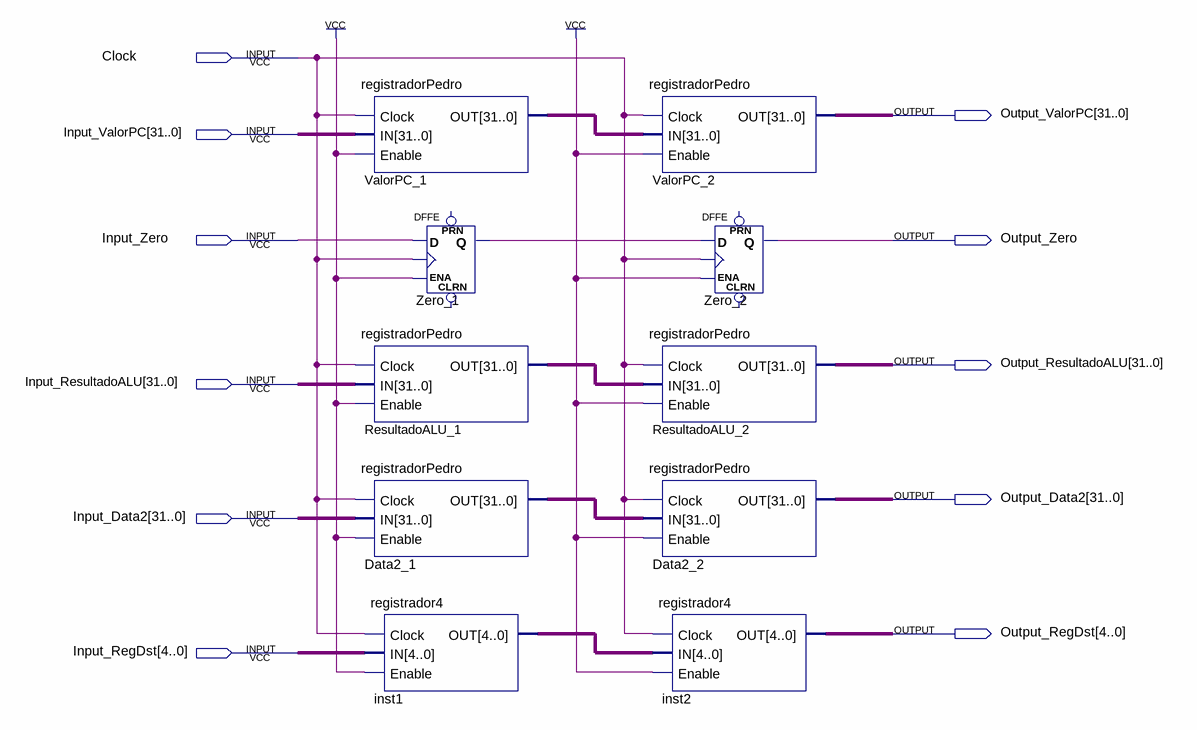
[diagram p0: schematic sheet]
// Quartus schematic barreira_EX_MEM.bdf as structural Verilog: 10 symbols, 11 pins
module barreira_EX_MEM (
  input  Clock,
  input  [31:0] Input_ValorPC,
  input  Input_Zero,
  input  [31:0] Input_ResultadoALU,
  input  [31:0] Input_Data2,
  input  [4:0] Input_RegDst,
  output [31:0] Output_ValorPC,
  output Output_Zero,
  output [31:0] Output_ResultadoALU,
  output [31:0] Output_Data2,
  output [4:0] Output_RegDst
);

  wire Zero_1_q;
  wire [4:0] inst1_out;
  wire [31:0] Data2_1_out, ResultadoALU_1_out, ValorPC_1_out;

  registradorPedro ValorPC_1 (.Clock(Clock), .IN(Input_ValorPC), .Enable(1'b1), .OUT(ValorPC_1_out));
  DFFE Zero_1 (.D(Input_Zero), .CLK(Clock), .ENA(1'b1), .Q(Zero_1_q));  // open: PRN, CLRN
  registradorPedro ResultadoALU_1 (.Clock(Clock), .IN(Input_ResultadoALU), .Enable(1'b1), .OUT(ResultadoALU_1_out));
  registradorPedro Data2_1 (.Clock(Clock), .IN(Input_Data2), .Enable(1'b1), .OUT(Data2_1_out));
  registrador4 inst1 (.Clock(Clock), .IN(Input_RegDst), .Enable(1'b1), .OUT(inst1_out));
  registradorPedro ValorPC_2 (.Clock(Clock), .IN(ValorPC_1_out), .Enable(1'b1), .OUT(Output_ValorPC));
  registradorPedro ResultadoALU_2 (.Clock(Clock), .IN(ResultadoALU_1_out), .Enable(1'b1), .OUT(Output_ResultadoALU));
  registradorPedro Data2_2 (.Clock(Clock), .IN(Data2_1_out), .Enable(1'b1), .OUT(Output_Data2));
  registrador4 inst2 (.Clock(Clock), .IN(inst1_out), .Enable(1'b1), .OUT(Output_RegDst));
  DFFE Zero_2 (.D(Zero_1_q), .CLK(Clock), .ENA(1'b1), .Q(Output_Zero));  // open: PRN, CLRN
endmodule
